# Altium schematic sheet IC_74HC595.SchDoc
size A; SheetNumber: 7; SheetTotal: 7
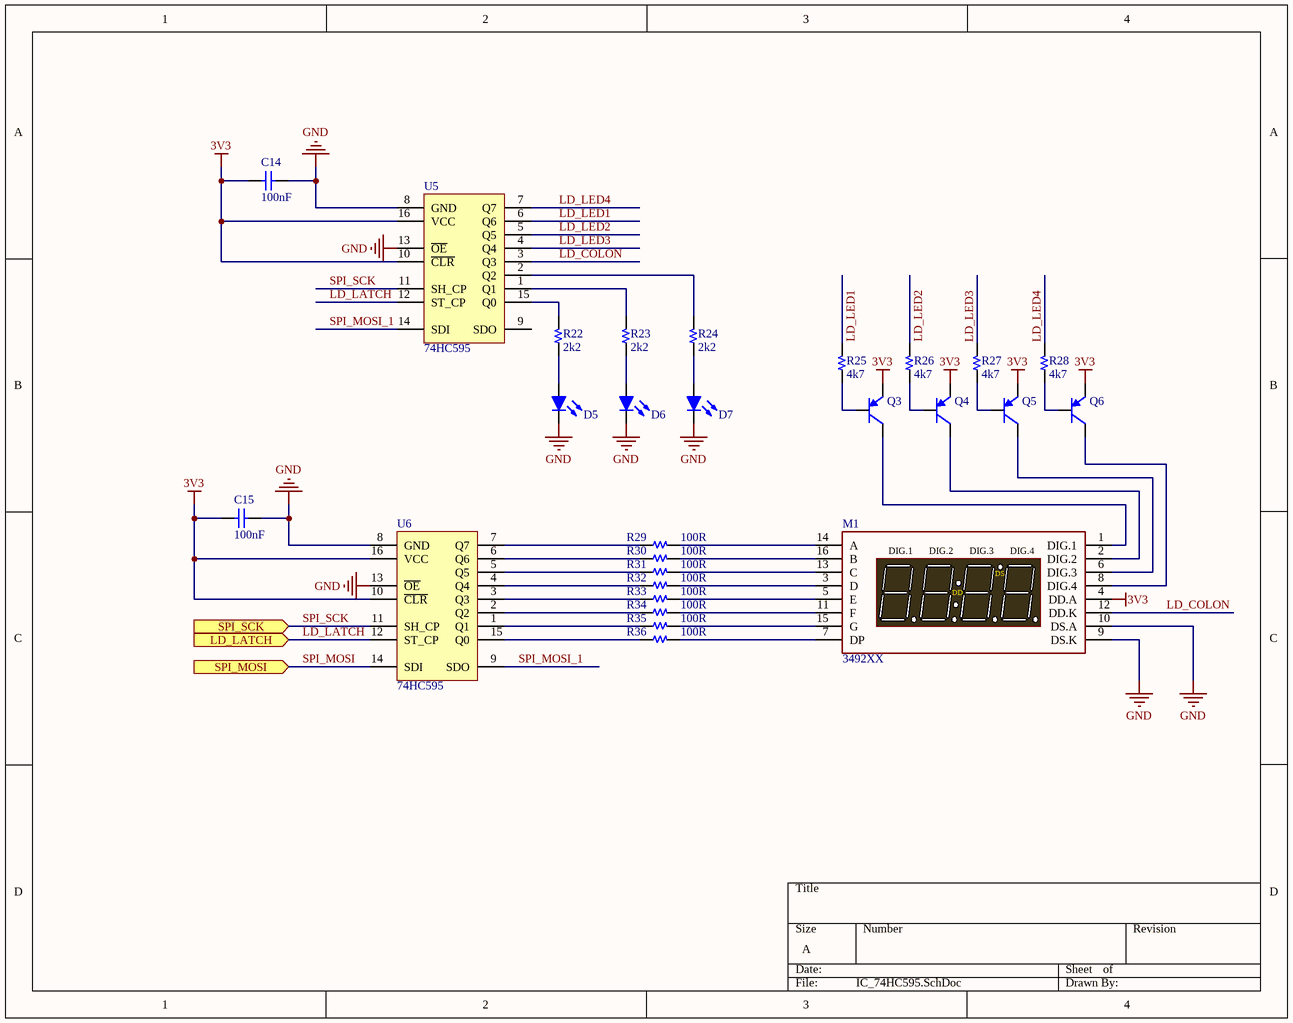
[diagram p0: IC_74HC595.SchDoc]

## Parts
C14  100nF  [C 0805]
C15  100nF  [C 0805]
D5  Led  [Led 0805]  (value not drawn)
D6  Led  [Led 0805]  (value not drawn)
D7  Led  [Led 0805]  (value not drawn)
M1  3492XX  [LED 7-SEG X4 3492XX]
Q3  Transistor PNP  [SOT-23]  (value not drawn)
Q4  Transistor PNP  [SOT-23]  (value not drawn)
Q5  Transistor PNP  [SOT-23]  (value not drawn)
Q6  Transistor PNP  [SOT-23]  (value not drawn)
R22  2k2  [R 0805]
R23  2k2  [R 0805]
R24  2k2  [R 0805]
R25  4k7  [R 0805]
R26  4k7  [R 0805]
R27  4k7  [R 0805]
R28  4k7  [R 0805]
R29  100R  [R 0805]
R30  100R  [R 0805]
R31  100R  [R 0805]
R32  100R  [R 0805]
R33  100R  [R 0805]
R34  100R  [R 0805]
R35  100R  [R 0805]
R36  100R  [R 0805]
U5  74HC595  [SOIC-16]
U6  74HC595  [SOIC-16]

## Ports
LD_LATCH (in, see ESP32_WROM_32[3A]), SPI_MOSI (in, see ESP32_WROM_32[2C]), SPI_SCK (in, see ESP32_WROM_32[3B])

## Nets
3V3: C14.1 C15.1 M1.4(DD.A) Q3.2(E) Q4.2(E) Q5.2(E) Q6.2(E) U5.10(~{CLR}) U5.16(VCC) U6.10(~{CLR}) U6.16(VCC)
GND: C14.2 C15.2 D5.2(K) D6.2(K) D7.2(K) M1.9(DS.K) M1.10(DS.A) U5.8(GND) U5.13(~{OE}) U6.8(GND) U6.13(~{OE})
LD_COLON: M1.12(DD.K) U5.3(Q3)
LD_LATCH: U5.12(ST_CP) U6.12(ST_CP) ; port LD_LATCH
LD_LED1: R25.2 U5.6(Q6)
LD_LED2: R26.2 U5.5(Q5)
LD_LED3: R27.2 U5.4(Q4)
LD_LED4: R28.2 U5.7(Q7)
SPI_MOSI: U6.14(SDI) ; port SPI_MOSI
SPI_MOSI_1: U5.14(SDI) U6.9(SDO)
SPI_SCK: U5.11(SH_CP) U6.11(SH_CP) ; port SPI_SCK
NetD5_1: D5.1(A) R22.1
NetD6_1: D6.1(A) R23.1
NetD7_1: D7.1(A) R24.1
NetM1_1: M1.1(DIG.1) Q3.3(C)
NetM1_2: M1.2(DIG.2) Q4.3(C)
NetM1_3: M1.3(D) R32.2
NetM1_5: M1.5(E) R33.2
NetM1_6: M1.6(DIG.3) Q5.3(C)
NetM1_7: M1.7(DP) R36.2
NetM1_8: M1.8(DIG.4) Q6.3(C)
NetM1_11: M1.11(F) R34.2
NetM1_13: M1.13(C) R31.2
NetM1_14: M1.14(A) R29.2
NetM1_15: M1.15(G) R35.2
NetM1_16: M1.16(B) R30.2
NetQ3_1: Q3.1(B) R25.1
NetQ4_1: Q4.1(B) R26.1
NetQ5_1: Q5.1(B) R27.1
NetQ6_1: Q6.1(B) R28.1
NetR22_2: R22.2 U5.15(Q0)
NetR23_2: R23.2 U5.1(Q1)
NetR24_2: R24.2 U5.2(Q2)
NetR29_1: R29.1 U6.7(Q7)
NetR30_1: R30.1 U6.6(Q6)
NetR31_1: R31.1 U6.5(Q5)
NetR32_1: R32.1 U6.4(Q4)
NetR33_1: R33.1 U6.3(Q3)
NetR34_1: R34.1 U6.2(Q2)
NetR35_1: R35.1 U6.1(Q1)
NetR36_1: R36.1 U6.15(Q0)

Not connected (* = marked no-connect by the designer): U5 9(SDO)

## Notes on the sheet
- (in symbol LED 7-SEG X4 3492) DS; DD

## Library data of the parts
C14 C15 = Capacitor NP: Capacitor non-pol
D5-D7 = Led: Typical LED
M1 = LED 7-SEG X4 3492: LED 7-seg x4 HDSP-B09G
Q3-Q6 = Transistor PNP: PNP Bipolar Transistor
R22-R36 = Resistor
U5 U6 = 74HC595: 8-bit serial-in, serial or parallel-out  shift register with output latches;  3-state